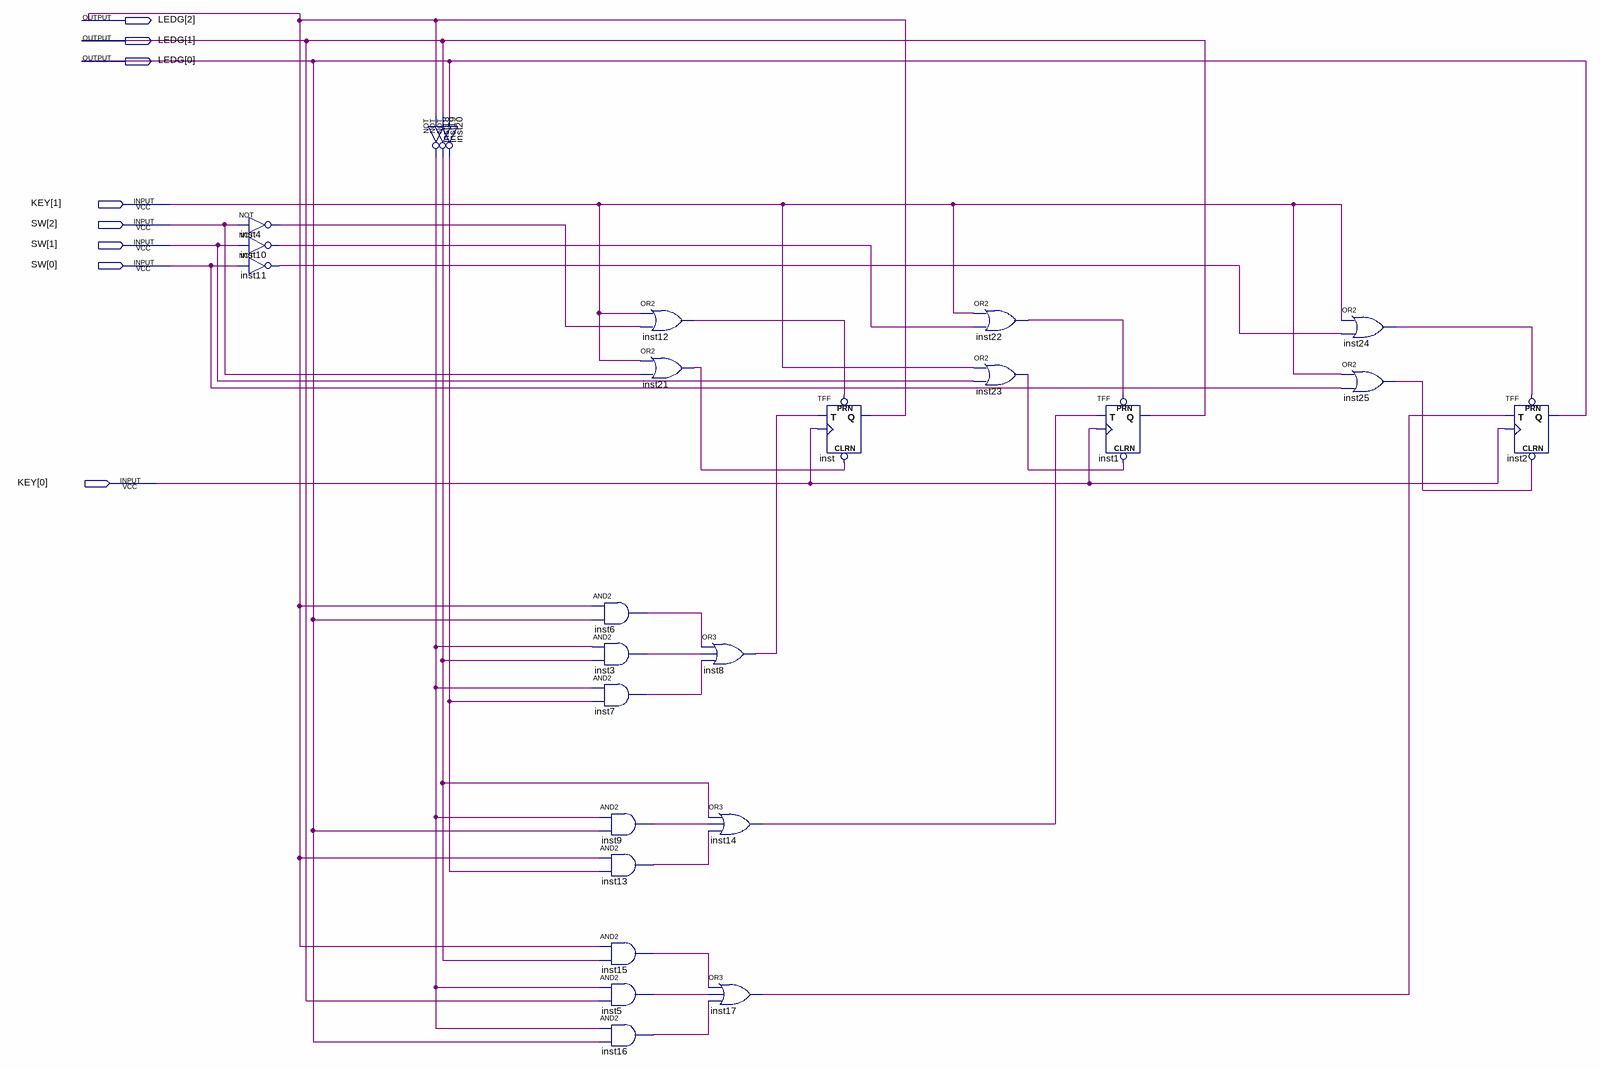
[diagram p0: schematic sheet]
// Quartus schematic lab1nap_22521588.bdf as structural Verilog: 26 symbols, 8 pins
module lab1nap_22521588 (
  input  [1:0] KEY,
  input  [2:0] SW,
  output [2:0] LEDG
);

  wire inst3_out, inst4_out, inst5_out, inst6_out, inst7_out, inst8_out, inst9_out, inst10_out, inst11_out,
       inst12_out, inst13_out, inst14_out, inst15_out, inst16_out, inst17_out, inst18_out, inst19_out,
       inst20_out, inst21_out, inst22_out, inst23_out, inst24_out, inst25_out;

  not inst4 (inst4_out, SW[2]);
  not inst10 (inst10_out, SW[1]);
  not inst11 (inst11_out, SW[0]);
  not inst18 (inst18_out, LEDG[2]);
  not inst19 (inst19_out, LEDG[1]);
  not inst20 (inst20_out, LEDG[0]);
  and inst6 (inst6_out, LEDG[2], LEDG[0]);
  and inst3 (inst3_out, inst18_out, inst19_out);
  and inst7 (inst7_out, inst18_out, inst20_out);
  and inst9 (inst9_out, inst18_out, LEDG[0]);
  and inst13 (inst13_out, LEDG[2], inst20_out);
  and inst15 (inst15_out, LEDG[2], inst19_out);
  and inst5 (inst5_out, inst18_out, LEDG[1]);
  and inst16 (inst16_out, inst18_out, LEDG[0]);
  or inst12 (inst12_out, KEY[1], inst4_out);
  or inst21 (inst21_out, KEY[1], SW[2]);
  or inst8 (inst8_out, inst6_out, inst3_out, inst7_out);
  or inst14 (inst14_out, inst19_out, inst9_out, inst13_out);
  or inst17 (inst17_out, inst15_out, inst5_out, inst16_out);
  TFF inst (.PRN(inst12_out), .CLRN(inst21_out), .T(inst8_out), .CLK(KEY[0]), .Q(LEDG[2]));
  or inst22 (inst22_out, KEY[1], inst10_out);
  or inst23 (inst23_out, KEY[1], SW[1]);
  TFF inst1 (.PRN(inst22_out), .CLRN(inst23_out), .T(inst14_out), .CLK(KEY[0]), .Q(LEDG[1]));
  or inst24 (inst24_out, KEY[1], inst11_out);
  or inst25 (inst25_out, KEY[1], SW[0]);
  TFF inst2 (.PRN(inst24_out), .CLRN(inst25_out), .T(inst17_out), .CLK(KEY[0]), .Q(LEDG[0]));
endmodule
